# EAGLE schematic main (EAGLE 9.6.2)
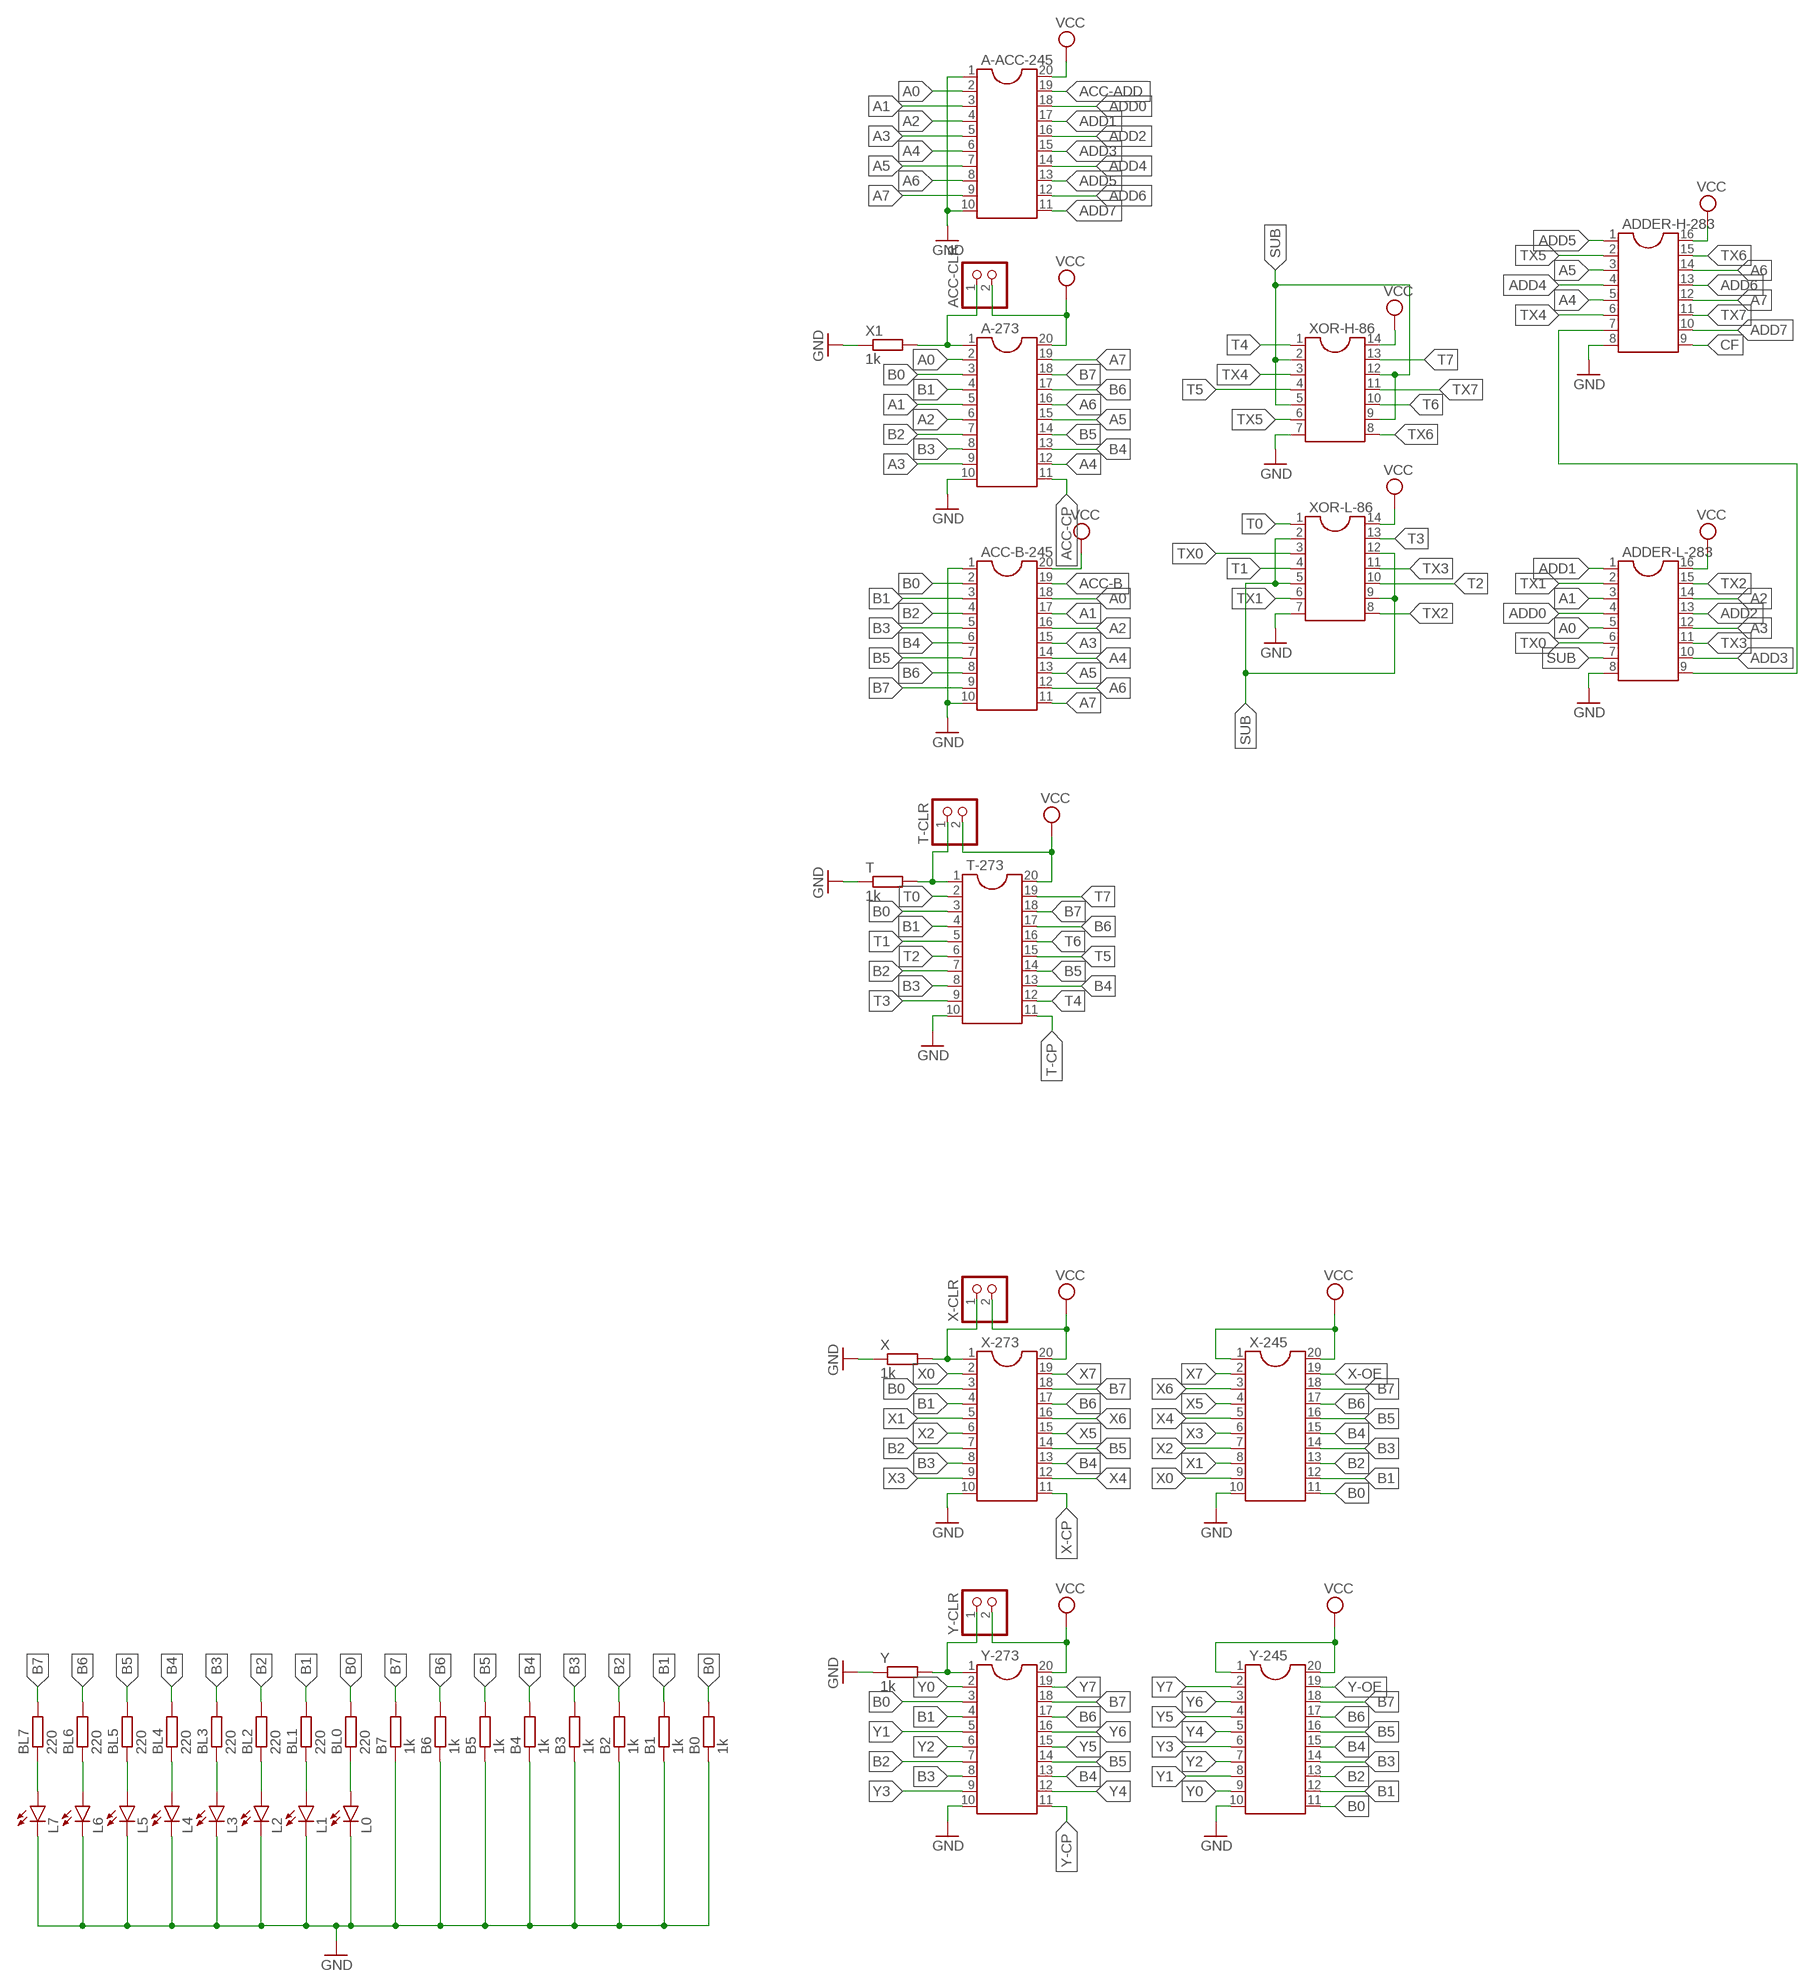
[diagram p0: schematic, sheet 1]

## Parts
A-273  DIL20S  [SOCKET-20]
A-ACC-245  DIL20S  [SOCKET-20]
ACC-B-245  DIL20S  [SOCKET-20]
ACC-CLR  PINHD-1X2  [1X02]
ADDER-H-283  DIL16S  [SOCKET-16]
ADDER-L-283  DIL16S  [SOCKET-16]
B0  1k  R-EU_0204/7  [0204/7]
B1  1k  R-EU_0204/7  [0204/7]
B2  1k  R-EU_0204/7  [0204/7]
B3  1k  R-EU_0204/7  [0204/7]
B4  1k  R-EU_0204/7  [0204/7]
B5  1k  R-EU_0204/7  [0204/7]
B6  1k  R-EU_0204/7  [0204/7]
B7  1k  R-EU_0204/7  [0204/7]
BL0  220  R-EU_0204/7  [0204/7]
BL1  220  R-EU_0204/7  [0204/7]
BL2  220  R-EU_0204/7  [0204/7]
BL3  220  R-EU_0204/7  [0204/7]
BL4  220  R-EU_0204/7  [0204/7]
BL5  220  R-EU_0204/7  [0204/7]
BL6  220  R-EU_0204/7  [0204/7]
BL7  220  R-EU_0204/7  [0204/7]
L0  LED5MM  [LED5MM]
L1  LED5MM  [LED5MM]
L2  LED5MM  [LED5MM]
L3  LED5MM  [LED5MM]
L4  LED5MM  [LED5MM]
L5  LED5MM  [LED5MM]
L6  LED5MM  [LED5MM]
L7  LED5MM  [LED5MM]
T  1k  R-EU_0204/7  [0204/7]
T-273  DIL20S  [SOCKET-20]
T-CLR  PINHD-1X2  [1X02]
X  1k  R-EU_0204/7  [0204/7]
X1  1k  R-EU_0204/7  [0204/7]
X-245  DIL20S  [SOCKET-20]
X-273  DIL20S  [SOCKET-20]
X-CLR  PINHD-1X2  [1X02]
XOR-H-86  DIL14S  [SOCKET-14]
XOR-L-86  DIL14S  [SOCKET-14]
Y  1k  R-EU_0204/7  [0204/7]
Y-245  DIL20S  [SOCKET-20]
Y-273  DIL20S  [SOCKET-20]
Y-CLR  PINHD-1X2  [1X02]

## Nets
A0: A-273.2 A-ACC-245.2 ACC-B-245.18 ADDER-L-283.5
A1: A-273.5 A-ACC-245.3 ACC-B-245.17 ADDER-L-283.3
A2: A-273.6 A-ACC-245.4 ACC-B-245.16 ADDER-L-283.14
A3: A-273.9 A-ACC-245.5 ACC-B-245.15 ADDER-L-283.12
A4: A-273.12 A-ACC-245.6 ACC-B-245.14 ADDER-H-283.5
A5: A-273.15 A-ACC-245.7 ACC-B-245.13 ADDER-H-283.3
A6: A-273.16 A-ACC-245.8 ACC-B-245.12 ADDER-H-283.14
A7: A-273.19 A-ACC-245.9 ACC-B-245.11 ADDER-H-283.12
ACC-ADD: A-ACC-245.19
ACC-B: ACC-B-245.19
ACC-CLR: A-273.1 ACC-CLR.1 X1.2
ACC-CP: A-273.11
ADD0: A-ACC-245.18 ADDER-L-283.4
ADD1: A-ACC-245.17 ADDER-L-283.1
ADD2: A-ACC-245.16 ADDER-L-283.13
ADD3: A-ACC-245.15 ADDER-L-283.10
ADD4: A-ACC-245.14 ADDER-H-283.4
ADD5: A-ACC-245.13 ADDER-H-283.1
ADD6: A-ACC-245.12 ADDER-H-283.13
ADD7: A-ACC-245.11 ADDER-H-283.10
B0: A-273.3 ACC-B-245.2 B0.2 BL0.2 T-273.3 X-245.11 X-273.3 Y-245.11 Y-273.3
B1: A-273.4 ACC-B-245.3 B1.2 BL1.2 T-273.4 X-245.12 X-273.4 Y-245.12 Y-273.4
B2: A-273.7 ACC-B-245.4 B2.2 BL2.2 T-273.7 X-245.13 X-273.7 Y-245.13 Y-273.7
B3: A-273.8 ACC-B-245.5 B3.2 BL3.2 T-273.8 X-245.14 X-273.8 Y-245.14 Y-273.8
B4: A-273.13 ACC-B-245.6 B4.2 BL4.2 T-273.13 X-245.15 X-273.13 Y-245.15 Y-273.13
B5: A-273.14 ACC-B-245.7 B5.2 BL5.2 T-273.14 X-245.16 X-273.14 Y-245.16 Y-273.14
B6: A-273.17 ACC-B-245.8 B6.2 BL6.2 T-273.17 X-245.17 X-273.17 Y-245.17 Y-273.17
B7: A-273.18 ACC-B-245.9 B7.2 BL7.2 T-273.18 X-245.18 X-273.18 Y-245.18 Y-273.18
BL0: BL0.1 L0.A
BL1: BL1.1 L1.A
BL2: BL2.1 L2.A
BL3: BL3.1 L3.A
BL4: BL4.1 L4.A
BL5: BL5.1 L5.A
BL6: BL6.1 L6.A
BL7: BL7.1 L7.A
C4: ADDER-H-283.7 ADDER-L-283.9
CF: ADDER-H-283.9
CLR: X-273.1 X-CLR.1 X.2
GND: A-273.10 A-ACC-245.1 A-ACC-245.10 ACC-B-245.1 ACC-B-245.10 ADDER-H-283.8 ADDER-L-283.8 B0.1 B1.1 B2.1 B3.1 B4.1 B5.1 B6.1 B7.1 L0.K(C) L1.K(C) L2.K(C) L3.K(C) L4.K(C) L5.K(C) L6.K(C) L7.K(C) T-273.10 T.1 X1.1 X-245.10 X-273.10 X.1 XOR-H-86.7 XOR-L-86.7 Y-245.10 Y-273.10 Y.1
SUB: ADDER-L-283.7 XOR-H-86.2 XOR-H-86.5 XOR-H-86.9 XOR-H-86.12 XOR-L-86.2 XOR-L-86.5 XOR-L-86.9 XOR-L-86.12
T0: T-273.2 XOR-L-86.1
T1: T-273.5 XOR-L-86.4
T2: T-273.6 XOR-L-86.10
T3: T-273.9 XOR-L-86.13
T4: T-273.12 XOR-H-86.1
T5: T-273.15 XOR-H-86.4
T6: T-273.16 XOR-H-86.10
T7: T-273.19 XOR-H-86.13
T-CLR: T-273.1 T-CLR.1 T.2
T-CP: T-273.11
TX0: ADDER-L-283.6 XOR-L-86.3
TX1: ADDER-L-283.2 XOR-L-86.6
TX2: ADDER-L-283.15 XOR-L-86.8
TX3: ADDER-L-283.11 XOR-L-86.11
TX4: ADDER-H-283.6 XOR-H-86.3
TX5: ADDER-H-283.2 XOR-H-86.6
TX6: ADDER-H-283.15 XOR-H-86.8
TX7: ADDER-H-283.11 XOR-H-86.11
VCC: A-273.20 A-ACC-245.20 ACC-B-245.20 ACC-CLR.2 ADDER-H-283.16 ADDER-L-283.16 T-273.20 T-CLR.2 X-245.1 X-245.20 X-273.20 X-CLR.2 XOR-H-86.14 XOR-L-86.14 Y-245.1 Y-245.20 Y-273.20 Y-CLR.2
X0: X-245.9 X-273.2
X1: X-245.8 X-273.5
X2: X-245.7 X-273.6
X3: X-245.6 X-273.9
X4: X-245.5 X-273.12
X5: X-245.4 X-273.15
X6: X-245.3 X-273.16
X7: X-245.2 X-273.19
X-CP: X-273.11
X-OE: X-245.19
Y0: Y-245.9 Y-273.2
Y1: Y-245.8 Y-273.5
Y2: Y-245.7 Y-273.6
Y3: Y-245.6 Y-273.9
Y4: Y-245.5 Y-273.12
Y5: Y-245.4 Y-273.15
Y6: Y-245.3 Y-273.16
Y7: Y-245.2 Y-273.19
Y-CLR: Y-273.1 Y-CLR.1 Y.2
Y-CP: Y-273.11
Y-OE: Y-245.19

## Library data of the parts
A-273 A-ACC-245 ACC-B-245 T-273 X-245 X-273 Y-245 Y-273 = ic-package:DIL20: Dual In Line / Socket
ACC-CLR T-CLR X-CLR Y-CLR = pinhead:PINHD-1X2: PIN HEADER
ADDER-H-283 ADDER-L-283 = ic-package:DIL16: Dual In Line / Socket
B0 B1-B7 BL0 BL1-BL7 T X X1 Y = rcl:R-EU_: RESISTOR, European symbol; SPICEPREFIX: R
L0 L1-L7 = led:LED: LED OSRAM: - CHIPLED LG R971, LG N971, LY N971, LG Q971, LY Q971, LO R971, LY R971 LH N974, LH R974 LS Q976, LO Q976, LY Q976 LO Q996 - Hyper CHIPLED LW Q18S LB Q993, LB Q99A, LB R99A - SideLED LS A670, LO A670, LY A670, LG A670, LP A670 LB A673, LV A673, LT A673, LW A673 LH A674 LY A675 LS A676, LA A676, LO A676, LY A676, LW A676 LS A679, LY A679, LG A679 - Hyper Micro SIDELED® LS Y876, LA Y876, LO Y876, LY Y876 LT Y87S - SmartLED LW L88C, LW L88S LB L89C, LB L89S, LG L890 LS L89K, LO L89K, LY L89K LS L896, LA L896, LO L896, LY L896 - TOPLED LS T670, LO T670, LY T670, LG T670, LP T670 LSG T670, LSP T670, LSY T670, LOP T670, LYG T670 LG T671, LOG T671, LSG T671 LB T673, LV T673, LT T673, LW T673 LH T674 LS T676, LA T676, LO T676, LY T676, LB T676, LH T676, LSB T676, LW T676 LB T67C, LV T67C, LT T67C, LS T67K, LO T67K, LY T67K, LW E67C LS E67B, LA E67B, LO E67B, LY E67B, LB E67C, LV E67C, LT E67C LW T67C LS T679, LY T679, LG T679 LS T770, LO T770, LY T770, LG T770, LP T770 LB T773, LV T773, LT T773, LW T773 LH T774 LS E675, LA E675, LY E675, LS T675 LS T776, LA T776, LO T776, LY T776, LB T776 LHGB T686 LT T68C, LB T68C - Hyper Mini TOPLED® LB M676 - Mini TOPLED Santana® LG M470 LS M47K, LO M47K, LY M47K Source: http://www.osram.convergy.de LUXEON: - LUMILED® LXK2-PW12-R00, LXK2-PW12-S00, LXK2-PW14-U00, LXK2-PW14-V00 LXK2-PM12-R00, LXK2-PM12-S00, LXK2-PM14-U00 LXK2-PE12-Q00, LXK2-PE12-R00, LXK2-PE12-S00, LXK2-PE14-T00, LXK2-PE14-U00 LXK2-PB12-K00, LXK2-PB12-L00, LXK2-PB12-M00, LXK2-PB14-N00, LXK2-PB14-P00, LXK2-PB14-Q00 LXK2-PR12-L00, LXK2-PR12-M00, LXK2-PR14-Q00, LXK2-PR14-R00 LXK2-PD12-Q00, LXK2-PD12-R00, LXK2-PD12-S00 LXK2-PH12-R00, LXK2-PH12-S00 LXK2-PL12-P00, LXK2-PL12-Q00, LXK2-PL12-R00 Source: www.luxeon.com KINGBRIGHT: KA-3528ASYC Source: www.kingbright.com
XOR-H-86 XOR-L-86 = ic-package:DIL14: Dual In Line / Socket